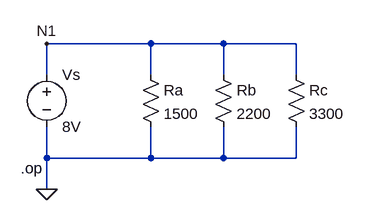
[diagram p0: schematic Circuito 1.asc]
Circuito 1.asc, the LTspice schematic file:
Version 4.1
SHEET 1 880 680
WIRE 224 80 64 80
WIRE 336 80 224 80
WIRE 448 80 336 80
WIRE 64 128 64 80
WIRE 224 128 224 80
WIRE 336 128 336 80
WIRE 448 128 448 80
WIRE 64 256 64 208
WIRE 224 256 224 208
WIRE 224 256 64 256
WIRE 336 256 336 208
WIRE 336 256 224 256
WIRE 448 256 448 208
WIRE 448 256 336 256
WIRE 64 304 64 256
FLAG 64 80 N1
FLAG 64 304 0
SYMBOL voltage 64 112 R0
SYMATTR InstName Vs
SYMATTR Value 8V
SYMBOL res 208 112 R0
SYMATTR InstName Ra
SYMATTR Value 1500
SYMBOL res 320 112 R0
SYMATTR InstName Rb
SYMATTR Value 2200
SYMBOL res 432 112 R0
SYMATTR InstName Rc
SYMATTR Value 3300
TEXT 24 272 Left 2 !.op

The netlist it stands for:
* Circuito 1.asc
Vs N1 0 8V
Ra N1 0 1500
Rb N1 0 2200
Rc N1 0 3300
.op
.backanno
.end